# Altium schematic sheet 02-MIC.SchDoc
size A4; SheetNumber: 2; SheetTotal: 3
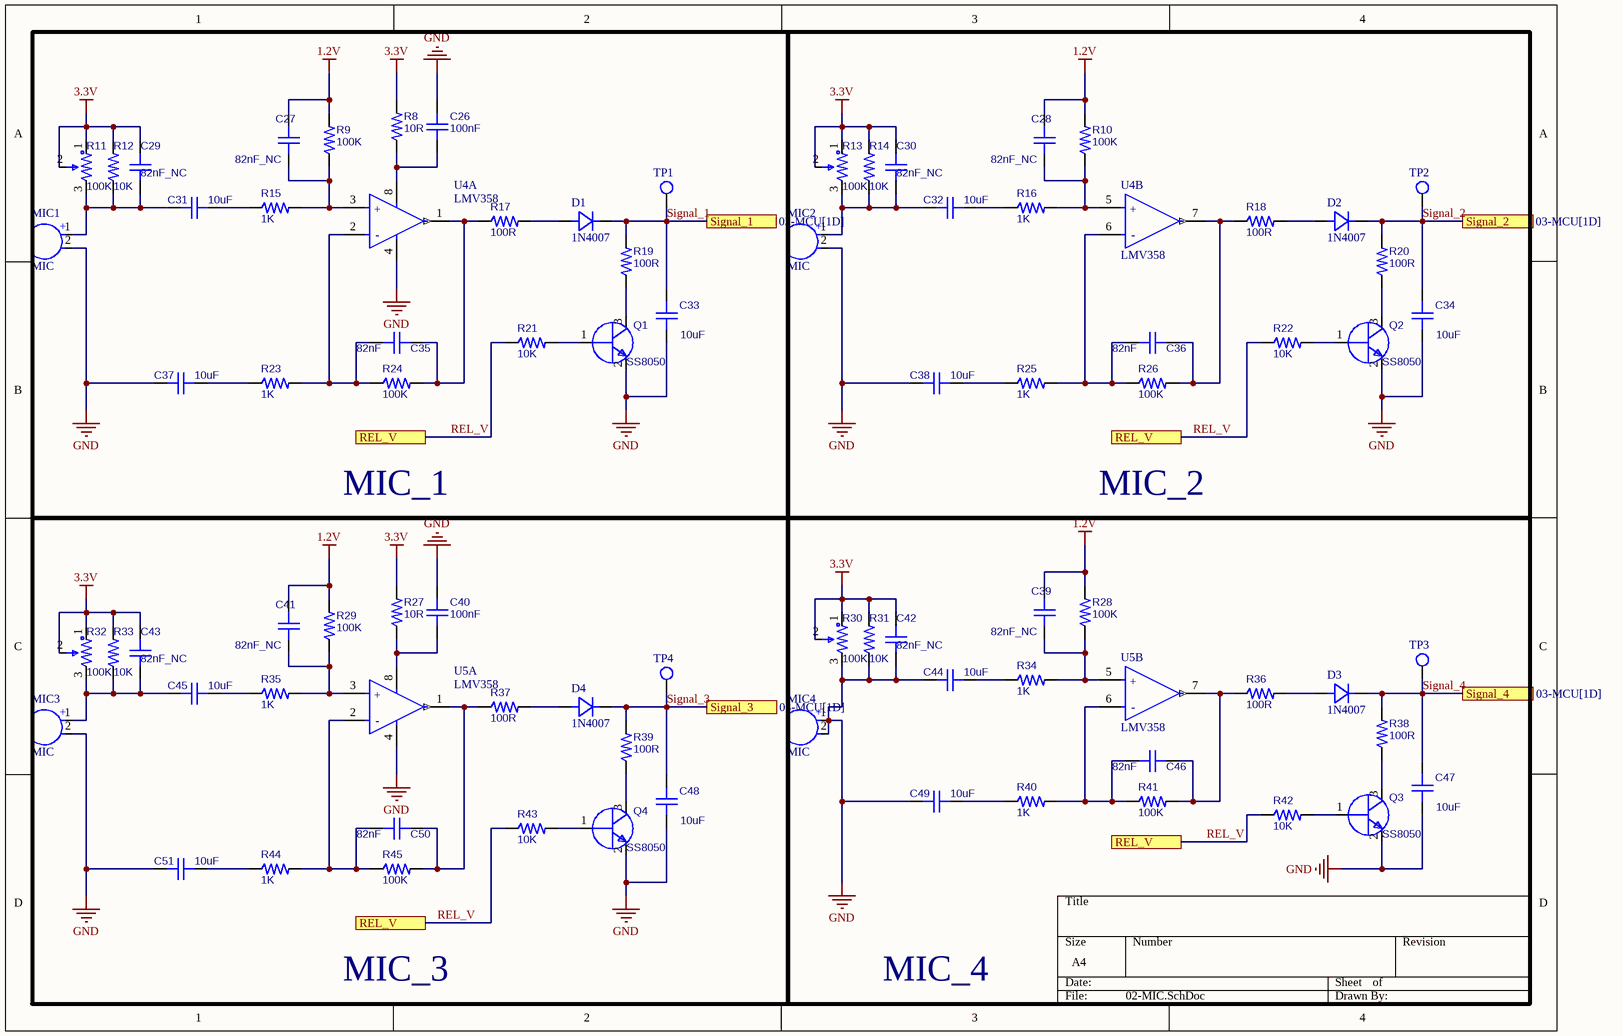
[diagram p0: 02-MIC.SchDoc]

## Parts
C26  100nF  [CAP-SMD-0603]
C27  82nF_NC  [CAP-SMD-0603]
C28  82nF_NC  [CAP-SMD-0603]
C29  82nF_NC  [CAP-SMD-0603]
C30  82nF_NC  [CAP-SMD-0603]
C31  10uF  [CAP-SMD-0603]
C32  10uF  [CAP-SMD-0603]
C33  10uF  [CAP-SMD-0603]
C34  10uF  [CAP-SMD-0603]
C35  82nF  [CAP-SMD-0603]
C36  82nF  [CAP-SMD-0603]
C37  10uF  [CAP-SMD-0603]
C38  10uF  [CAP-SMD-0603]
C39  82nF_NC  [CAP-SMD-0603]
C40  100nF  [CAP-SMD-0603]
C41  82nF_NC  [CAP-SMD-0603]
C42  82nF_NC  [CAP-SMD-0603]
C43  82nF_NC  [CAP-SMD-0603]
C44  10uF  [CAP-SMD-0603]
C45  10uF  [CAP-SMD-0603]
C46  82nF  [CAP-SMD-0603]
C47  10uF  [CAP-SMD-0603]
C48  10uF  [CAP-SMD-0603]
C49  10uF  [CAP-SMD-0603]
C50  82nF  [CAP-SMD-0603]
C51  10uF  [CAP-SMD-0603]
D1  1N4007  [SOD-123-P3.4]
D2  1N4007  [SOD-123-P3.4]
D3  1N4007  [SOD-123-P3.4]
D4  1N4007  [SOD-123-P3.4]
MIC1  MIC  [MIC-TH-BD4.0-P1.4]
MIC2  MIC  [MIC-TH-BD4.0-P1.4]
MIC3  MIC  [MIC-TH-BD4.0-P1.4]
MIC4  MIC  [MIC-TH-BD4.0-P1.4]
Q1  SS8050  [SOT-23-3-LP2.28-P1.91]
Q2  SS8050  [SOT-23-3-LP2.28-P1.91]
Q3  SS8050  [SOT-23-3-LP2.28-P1.91]
Q4  SS8050  [SOT-23-3-LP2.28-P1.91]
R8  10R  [RES-SMD-0603]
R9  100K  [RES-SMD-0603]
R10  100K  [RES-SMD-0603]
R11  100K  [RES-SMD-ADJ-3224W]
R12  10K  [RES-SMD-0603]
R13  100K  [RES-SMD-ADJ-3224W]
R14  10K  [RES-SMD-0603]
R15  1K  [RES-SMD-0603]
R16  1K  [RES-SMD-0603]
R17  100R  [RES-SMD-0603]
R18  100R  [RES-SMD-0603]
R19  100R  [RES-SMD-0603]
R20  100R  [RES-SMD-0603]
R21  10K  [RES-SMD-0603]
R22  10K  [RES-SMD-0603]
R23  1K  [RES-SMD-0603]
R24  100K  [RES-SMD-0603]
R25  1K  [RES-SMD-0603]
R26  100K  [RES-SMD-0603]
R27  10R  [RES-SMD-0603]
R28  100K  [RES-SMD-0603]
R29  100K  [RES-SMD-0603]
R30  100K  [RES-SMD-ADJ-3224W]
R31  10K  [RES-SMD-0603]
R32  100K  [RES-SMD-ADJ-3224W]
R33  10K  [RES-SMD-0603]
R34  1K  [RES-SMD-0603]
R35  1K  [RES-SMD-0603]
R36  100R  [RES-SMD-0603]
R37  100R  [RES-SMD-0603]
R38  100R  [RES-SMD-0603]
R39  100R  [RES-SMD-0603]
R40  1K  [RES-SMD-0603]
R41  100K  [RES-SMD-0603]
R42  10K  [RES-SMD-0603]
R43  10K  [RES-SMD-0603]
R44  1K  [RES-SMD-0603]
R45  100K  [RES-SMD-0603]
TP1  TP  [TP]  (value not drawn)
TP2  TP  [TP]  (value not drawn)
TP3  TP  [TP]  (value not drawn)
TP4  TP  [TP]  (value not drawn)
U4  LMV358  [SOIC-8-LP5.5-P1.27]  (parts A,B of 2)
U5  LMV358  [SOIC-8-LP5.5-P1.27]  (parts A,B of 2)

## Blocks framed on the sheet
MIC_1: C26 C27 C29 C31 C33 C35 C37 D1 MIC1 Q1 R8 R9 R11 R12 R15 R17 R19 R21 R23 R24 TP1 U4
MIC_2: C28 C30 C32 C34 C36 C38 D2 MIC2 Q2 R10 R13 R14 R16 R18 R20 R22 R25 R26 TP2 U4
MIC_3: C40 C41 C43 C45 C48 C50 C51 D4 MIC3 Q4 R27 R29 R32 R33 R35 R37 R39 R43-R45 TP4 U5
MIC_4: C39 C42 C44 C46 C47 C49 D3 MIC4 Q3 R28 R30 R31 R34 R36 R38 R40-R42 TP3 U5

## Ports
REL_V (see 02-MIC[1B], 02-MIC[1D], 02-MIC[3B], 03-MCU[8C]), REL_V (see 02-MIC[1B], 02-MIC[1D], 02-MIC[3D], 03-MCU[8C]), REL_V (see 02-MIC[1B], 02-MIC[3B], 02-MIC[3D], 03-MCU[8C]), REL_V (see 02-MIC[1D], 02-MIC[3B], 02-MIC[3D], 03-MCU[8C]), Signal_1 (see 03-MCU[1D]), Signal_2 (see 03-MCU[1D]), Signal_3 (see 03-MCU[1D]), Signal_4 (see 03-MCU[1D])

## Nets
1.2V: C27.2 C28.2 C39.2 C41.2 R9.2 R10.2 R28.2 R29.2
3.3V: C29.2 C30.2 C42.2 C43.2 R8.2 R11.1 R11.2 R12.2 R13.1 R13.2 R14.2 R27.2 R30.1 R30.2 R31.2 R32.1 R32.2 R33.2
GND: C26.2 C33.1 C34.1 C37.1 C38.1 C40.2 C42.1 C44.1 C47.1 C48.1 C49.1 C51.1 MIC1.2(C) MIC2.2(C) MIC3.2(C) MIC4.1(A) MIC4.2(C) Q1.2(E) Q2.2(E) Q3.2(E) Q4.2(E) R30.3 R31.1 U4.4(GND) U5.4(GND)
REL_V: R21.1 R22.1 R42.1 R43.1 ; port REL_V
Signal_1: C33.2 D1.2(A) R19.2 TP1.1 ; port Signal_1
Signal_2: C34.2 D2.2(A) R20.2 TP2.1 ; port Signal_2
Signal_3: C48.2 D4.2(A) R39.2 TP4.1 ; port Signal_3
Signal_4: C47.2 D3.2(A) R38.2 TP3.1 ; port Signal_4
NetC26_1: C26.1 R8.1 U4.8(VCC+)
NetC27_1: C27.1 R9.1 R15.2 U4.3(1IN+)
NetC28_1: C28.1 R10.1 R16.2 U4.5(1IN+)
NetC29_1: C29.1 C31.1 MIC1.1(A) R11.3 R12.1
NetC30_1: C30.1 C32.1 MIC2.1(A) R13.3 R14.1
NetC31_2: C31.2 R15.1
NetC32_2: C32.2 R16.1
NetC35_1: C35.1 R23.2 R24.1 U4.2(1IN-)
NetC35_2: C35.2 R17.1 R24.2 U4.1(OUT)
NetC36_1: C36.1 R25.2 R26.1 U4.6(1IN-)
NetC36_2: C36.2 R18.1 R26.2 U4.7(OUT)
NetC37_2: C37.2 R23.1
NetC38_2: C38.2 R25.1
NetC39_1: C39.1 R28.1 R34.2 U5.5(1IN+)
NetC40_1: C40.1 R27.1 U5.8(VCC+)
NetC41_1: C41.1 R29.1 R35.2 U5.3(1IN+)
NetC43_1: C43.1 C45.1 MIC3.1(A) R32.3 R33.1
NetC44_2: C44.2 R34.1
NetC45_2: C45.2 R35.1
NetC46_1: C46.1 R40.2 R41.1 U5.6(1IN-)
NetC46_2: C46.2 R36.1 R41.2 U5.7(OUT)
NetC49_2: C49.2 R40.1
NetC50_1: C50.1 R44.2 R45.1 U5.2(1IN-)
NetC50_2: C50.2 R37.1 R45.2 U5.1(OUT)
NetC51_2: C51.2 R44.1
NetD1_1: D1.1(K) R17.2
NetD2_1: D2.1(K) R18.2
NetD3_1: D3.1(K) R36.2
NetD4_1: D4.1(K) R37.2
NetQ1_1: Q1.1(B) R21.2
NetQ1_3: Q1.3(C) R19.1
NetQ2_1: Q2.1(B) R22.2
NetQ2_3: Q2.3(C) R20.1
NetQ3_1: Q3.1(B) R42.2
NetQ3_3: Q3.3(C) R38.1
NetQ4_1: Q4.1(B) R43.2
NetQ4_3: Q4.3(C) R39.1

## Notes on the sheet
- (in symbol LMV358, part A) +; -
- (in symbol LMV358, part B) +; -
- (in symbol MIC) +

## Library data of the parts
C26-C51 = CAP: 贴片电容; BOM_Manufacturer: SAMSUNG; BOM_Manufacturer Part: CL03A104KQ3NNNC; nameAlias: Capacitance; Contributor: LCSC; BOM_Supplier: LCSC; BOM_Supplier Part: C160831; BOM_JLCPCB Part Class: Extended Part; spicePre: C; spiceSymbolName: CL03A104KQ3NNNC
D1-D4 = Diode: 二极管1N4148W; Manufacturer: PSI(宝力芯); Symbol: 1N4148W_C2840890; Add into BOM: yes; Power Dissipation: 350mW; Reverse Voltage (Vr): 100V; Average Rectified Current (Io): 150mA; Forward Voltage (Vf@If): 1.25V@150mA; Reverse Leakage Current: 1A@75V; Reverse Recovery Time (trr): 4ns; Device: 1N4148W; LCSC Part Name: 100V 150mA 4ns; Supplier Part: C2840890; Manufacturer Part: 1N4148W; Supplier Footprint: SOD-123; JLCPCB Part Class: Extended Part; Datasheet: https://atta.szlcsc.com/upload/public/pdf/source/20210709/C2840890_3AF002B6505A4091F26B54E36362ABEF.pdf; Supplier: LCSC; Convert to PCB: yes; Diode Configuration: -; Operating Temperature: +150@(Tj)
MIC1-MIC4 = MIC: 咪头MIC COND ANALOG OMNI -38DB
Q1-Q4 = NPN-SOT-23-3: 贴片NPN三极管; BOM_Manufacturer: YFW佑风微; BOM_Manufacturer Part: S9013; Contributor: LCSC; BOM_Supplier: LCSC; BOM_Supplier Part: C2898668; BOM_JLCPCB Part Class: Extended Part; spicePre: Q; spiceSymbolName: S9013_C2898668
R8 R12 R14-R23 R25 R27 R31 R33-R40 R42-R44 = RES: 贴片电阻; BOM_Manufacturer: Chengdu Guosheng Tech; BOM_Manufacturer Part: 3362P-1-104; Resistance(Ohms): 100K; nameAlias: Resistance; Contributor: LCSC; BOM_Supplier: LCSC; BOM_Supplier Part: C118966; Resistance (Ohms): 100K; BOM_JLCPCB Part Class: Extended Part; spicePre: R; spiceSymbolName: 3362P-1-104_C118966
R9 R10 R24 R26 R28 R29 R41 R45 = RES: 贴片电阻; BOM_Manufacturer: Chengdu Guosheng Tech; BOM_Manufacturer Part: 3362P-1-104; nameAlias: Resistance; Contributor: LCSC; BOM_Supplier: LCSC; BOM_Supplier Part: C118966; Resistance(Ohms): 100K; Resistance (Ohms): 100K; BOM_JLCPCB Part Class: Extended Part; spicePre: R; spiceSymbolName: 3362P-1-104_C118966
R11 R13 R30 R32 = RES-ADJ: 可调电阻,电位器; BOM_Manufacturer: Chengdu Guosheng Tech; BOM_Manufacturer Part: 3362P-1-104; nameAlias: Resistance; Contributor: LCSC; BOM_Supplier: LCSC; BOM_Supplier Part: C118966; Resistance(Ohms): 100K; Resistance (Ohms): 100K; BOM_JLCPCB Part Class: Extended Part; spicePre: R; spiceSymbolName: 3362P-1-104_C118966
TP1-TP4 = TP: TP测试点
U4 U5 = LMV358: 运放IC OPAMP GP 2 CIRCUIT 8SOIC